# EAGLE design pwm-555 (EAGLE 6.4)
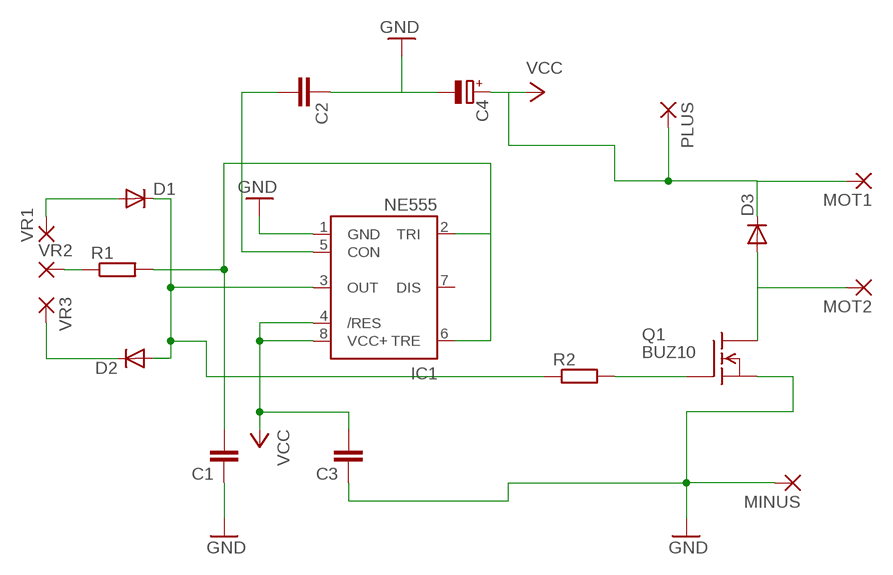
[diagram p0: schematic, sheet 1]

## Parts
C1  C-EU050-030X075  [C050-030X075]
C2  C-EU050-030X075  [C050-030X075]
C3  C-EU050-030X075  [C050-030X075]
C4  CPOL-EUE2-5  [E2-5]
D1  DIODE-D-7.5  [D-7.5]
D2  DIODE-D-7.5  [D-7.5]
D3  DIODE-D-7.5  [D-7.5]
IC1  NE555  [DIL-08]
MINUS  2,54/0,9  [2,54/0,9]
MOT1  2,54/0,9  [2,54/0,9]
MOT2  2,54/0,9  [2,54/0,9]
PLUS  2,54/0,9  [2,54/0,9]
Q1  BUZ10  [TO220]
R1  R-EU_0204/7  [0204/7]
R2  R-EU_0204/7  [0204/7]
VR1  2,54/0,9  [2,54/0,9]
VR2  2,54/0,9  [2,54/0,9]
VR3  2,54/0,9  [2,54/0,9]

## Nets
GND: C1.1 C2.1 C3.1 C4.- IC1.1(GND) MINUS.1(P) Q1.3(S)
MOT: D3.A MOT2.1(P) Q1.2(D)
N$1: D1.A VR1.1(P)
N$2: D2.C VR3.1(P)
N$3: R1.1 VR2.1(P)
N$4: C1.2 IC1.2(TRI) IC1.6(TRE) R1.2
N$6: D1.C D2.A IC1.3(OUT) R2.1
N$8: Q1.1(G) R2.2
N$10: C2.2 IC1.5(CON)
VCC: C3.2 C4.+ D3.C IC1.4(/RES) IC1.8(VCC+) MOT1.1(P) PLUS.1(P)
Unconnected: IC1.7(DIS)

## Library data of the parts
C1-C3 = rcl:C-EU: CAPACITOR, European symbol
C4 = rcl:CPOL-EU: POLARIZED CAPACITOR, European symbol
D1-D3 = diode:DIODE-: DIODE
IC1 = st-microelectronics:NE555: General purpose bipolar Timer; MF: Arrow Electronics; MPN: NE555N; OC_FARNELL: 1467742; OC_NEWARK: 89K1486
MINUS MOT1 MOT2 PLUS VR1-VR3 = wirepad:2,54/0,9: THROUGH-HOLE PAD
Q1 = transistor-fet:BUZ10: N-Channel Enhancement MOSFET 50V; 20A; 0,080Ohm
R1 R2 = resistor:R-EU_: RESISTOR, European symbol

## Board
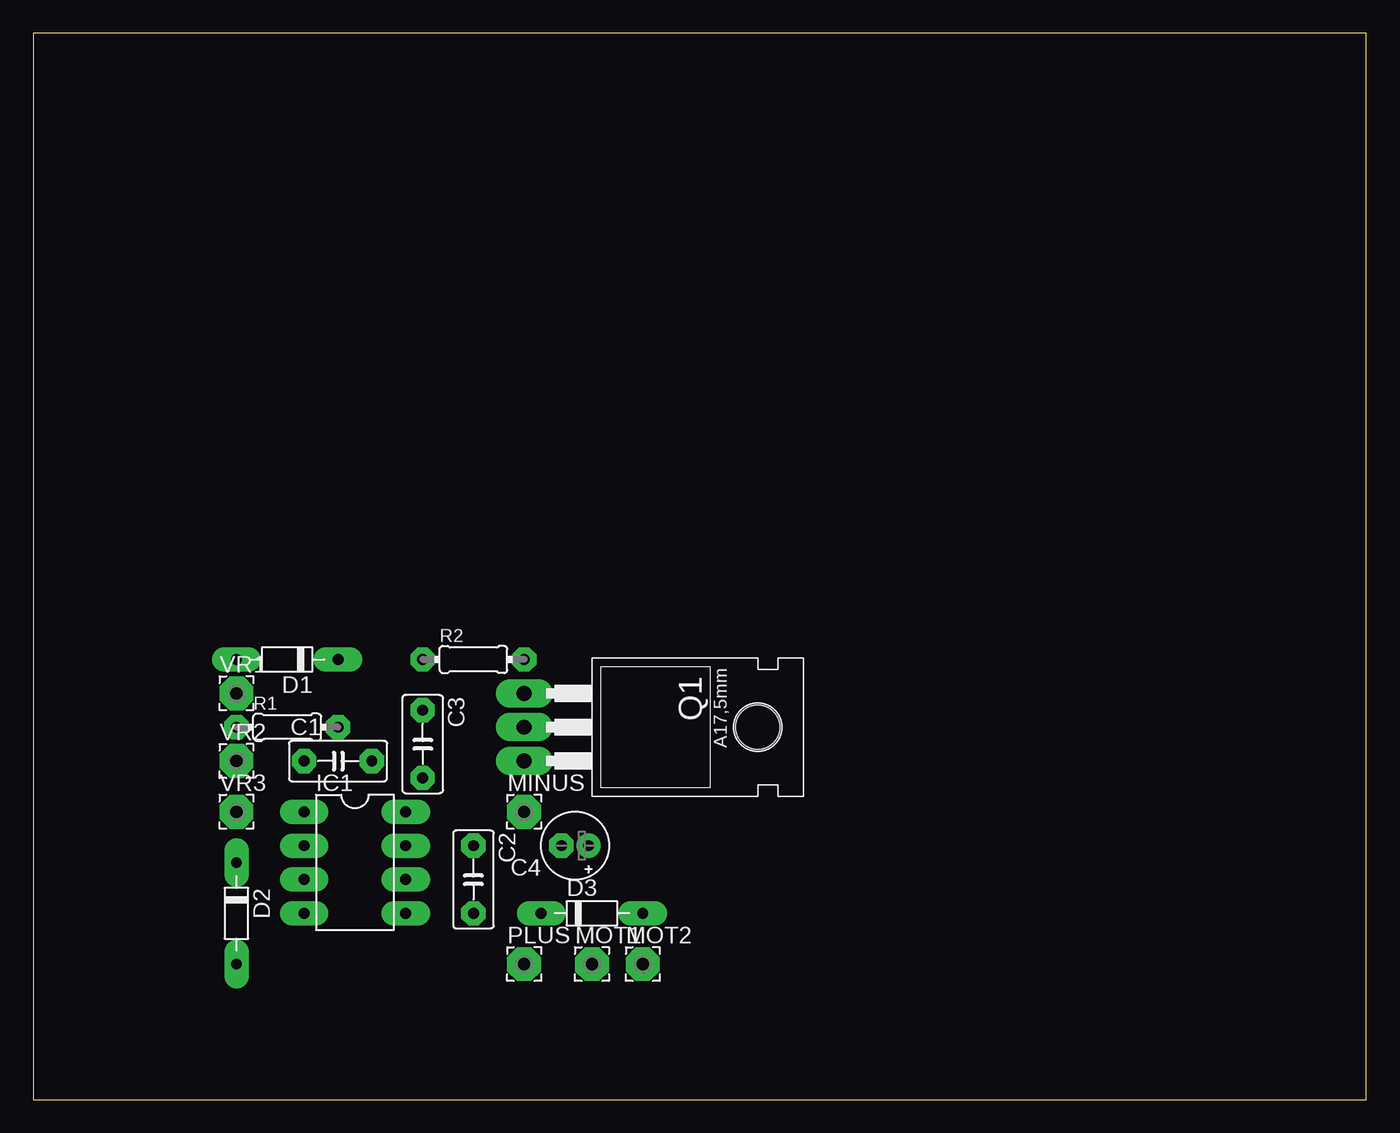
[diagram p1: board, top side]
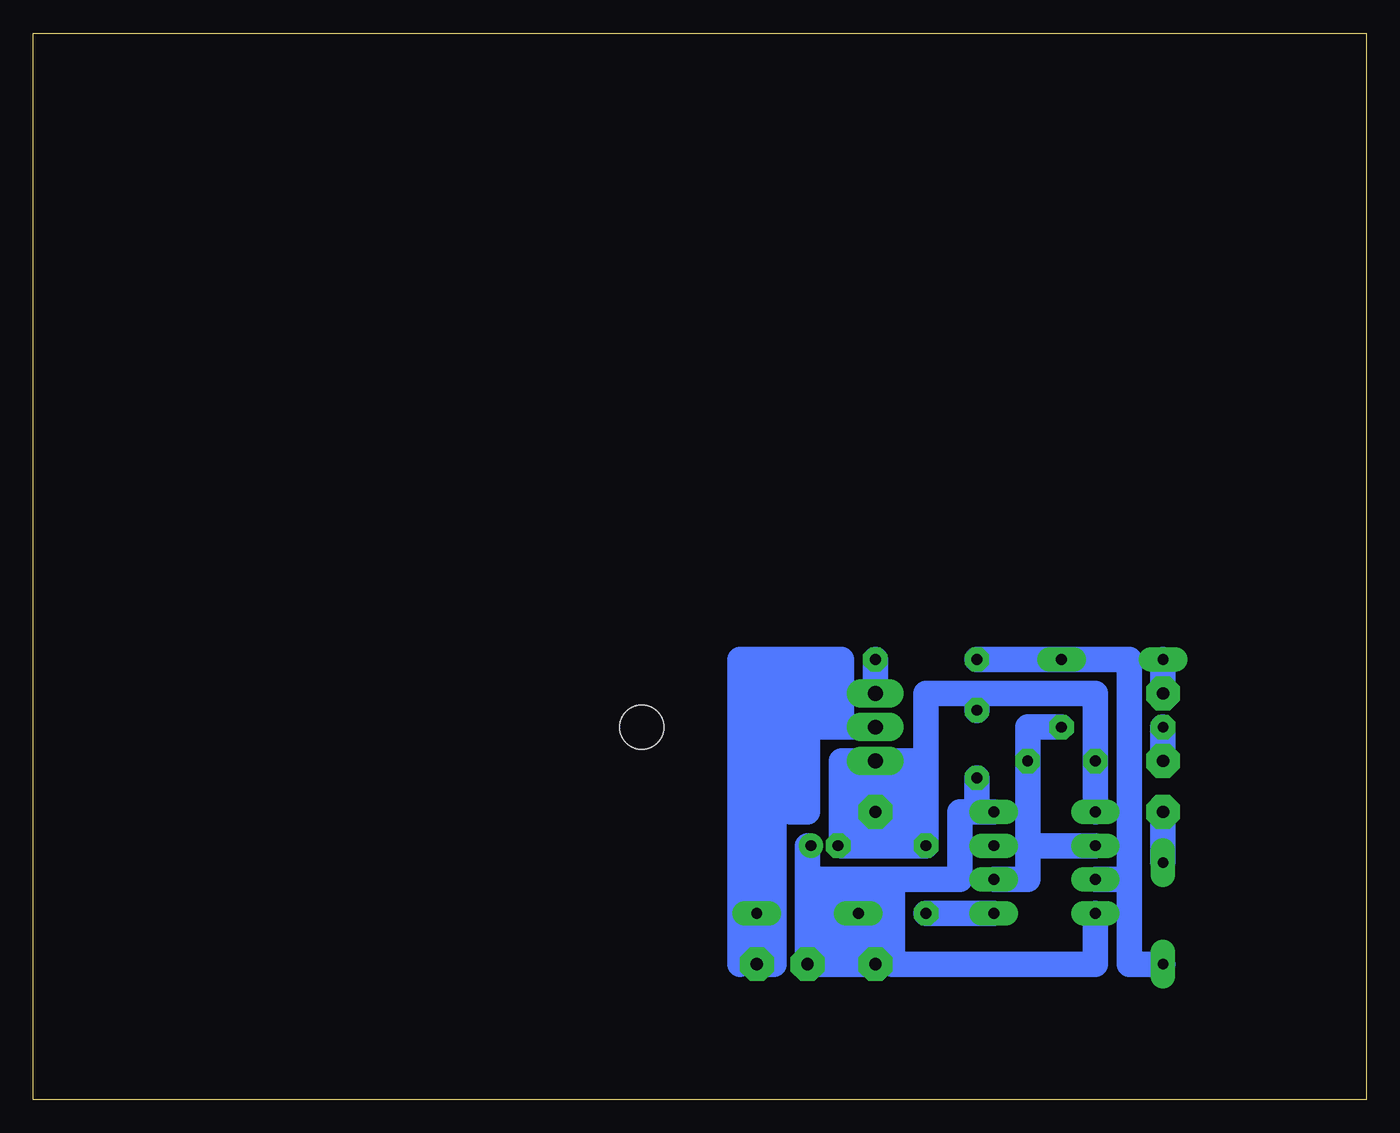
[diagram p2: board, bottom side, seen from below]

Size 100 x 80 mm. Coordinates in mm from the lower left corner, seen from the top.
Outline: 0,0 100,0 100,80 0,80 0,0
Copper layers (1*16): Top 0.035mm / dielectric 1.5mm / Bottom 0.035mm
Design rules "default *": minimum track width 10mil, minimum drill 24mil, track to track 8mil, track to pad 8mil, pad to pad 8mil, via to via 8mil, smd to smd 8mil, copper to edge 40mil, drill to drill 8mil, minimum pad ring 20mil, minimum via ring 8mil, stop-mask expansion 4mil, vias tented up to drill 0mil, thermal gap 10mil

### Footprints (pad centres in the part's own frame; a part is rotated, then mirrored left to right if it is on the bottom)
C050-030X075 = drill 0.813 octagon: 1 -2.54,0; 2 2.54,0
E2-5 = drill 0.813 pad 1.27: + -1.016,0 | drill 0.813 pad 1.27 octagon: - 1.016,0
D-7.5 = drill 0.813 long: A 3.81,0; C -3.81,0
DIL-08 = drill 0.813 long: 1 -3.81,-3.81; 2 -1.27,-3.81; 3 1.27,-3.81; 4 3.81,-3.81; 5 3.81,3.81; 6 1.27,3.81; 7 -1.27,3.81; 8 -3.81,3.81
2,54/0,9 = drill 0.914 pad 2.54 octagon: 1 0,0
TO220 = drill 1.118 long: 1 -2.54,-6.35; 2 0,-6.35; 3 2.54,-6.35 | hole 3.302: 0,11.176
0204/7 = drill 0.813 octagon: 1 -3.81,0; 2 3.81,0

### Placement (x,y rotation side)
C1  22.86,25.4 0 top
C2  33.02,16.51 270 top
C3  29.21,26.67 270 top
C4  40.64,19.05 180 top
D1  19.05,33.02 180 top
D2  15.24,13.97 270 top
D3  41.91,13.97 0 top
IC1  24.13,17.78 270 top
MINUS  36.83,21.59 0 top
MOT1  41.91,10.16 0 top
MOT2  45.72,10.16 0 top
PLUS  36.83,10.16 0 top
Q1  43.18,27.94 270 top
R1  19.05,27.94 0 top
R2  33.02,33.02 0 top
VR1  15.24,30.48 0 top
VR2  15.24,25.4 0 top
VR3  15.24,21.59 0 top

### Tracks (layer width: path | path; a pad name or v marks a point on that pad's centre or on a via)
GND
  Bottom 1.27: 39.37,19.05 C4.-
  Bottom 1.422: 36.83,24.13 36.83,22.86 MINUS.1 | MINUS.1 36.83,19.05 | 38.1,25.4 38.1,20.32 | 36.83,20.32 MINUS.1
  Bottom 1.93: IC1.1 C1.1 20.32,30.48 29.21,30.48 | C3.1 29.21,30.48 | 29.21,30.48 33.02,30.48 33.02,25.4 | 33.02,25.4 C2.1 36.83,19.05 39.37,19.05 39.37,25.4 38.1,25.4 Q1.3 33.02,25.4 | 38.1,20.32 36.83,20.32
MOT
  Bottom 1.422: 41.91,27.94 44.45,27.94 | MOT2.1 46.99,10.16 | 46.99,27.94 45.72,27.94 45.72,31.75 | 40.64,31.75 40.64,29.21
  Bottom 1.93: Q1.2 39.37,27.94 | 39.37,27.94 41.91,27.94 41.91,21.59 43.18,21.59 43.18,26.67 | 46.99,10.16 46.99,27.94 46.99,33.02 39.37,33.02 39.37,27.94 | 45.72,31.75 40.64,31.75 | 40.64,29.21 43.18,29.21 | 44.45,29.21 43.18,29.21 | 43.18,29.21 43.18,30.48 | 43.18,30.48 41.91,30.48 | 43.18,30.48 44.45,30.48 | MOT2.1 D3.A 45.72,27.94 44.45,27.94 44.45,10.16 MOT2.1
N$1
  Bottom 1.93: VR1.1 D1.A
N$2
  Bottom 1.93: VR3.1 D2.C
N$3
  Bottom 1.93: VR2.1 R1.1
N$4
  Bottom 1.93: 25.4,19.05 C1.2 25.4,27.94 R1.2 | IC1.6 25.4,16.51 25.4,19.05 | 25.4,19.05 IC1.2
N$6
  Bottom 1.93: 17.78,16.51 17.78,33.02 D1.C R2.1 | IC1.3 17.78,16.51 | 17.78,16.51 17.78,10.16 D2.A
N$8
  Bottom 1.93: R2.2 Q1.1
N$10
  Bottom 1.93: IC1.5 C2.2
VCC
  Bottom 1.422: 29.21,21.59 IC1.8 | 38.1,16.51 D3.C | C4.+ 41.91,19.05 | 36.83,16.51 PLUS.1 35.56,10.16 | 39.37,12.7 38.1,12.7
  Bottom 1.93: D3.C PLUS.1 MOT1.1 41.91,16.51 | IC1.4 20.32,10.16 35.56,10.16 35.56,11.43 | C3.2 29.21,21.59 | IC1.8 30.48,21.59 30.48,16.51 35.56,16.51 | 35.56,16.51 36.83,16.51 38.1,16.51 41.91,16.51 | 41.91,19.05 41.91,16.51 | 35.56,11.43 35.56,16.51 | 35.56,11.43 40.64,11.43 40.64,15.24 39.37,15.24 39.37,12.7
(copper drawn outside any net)
  shapes: Bottom area x1